# EAGLE design SBV0.3 (EAGLE 7.7.0)
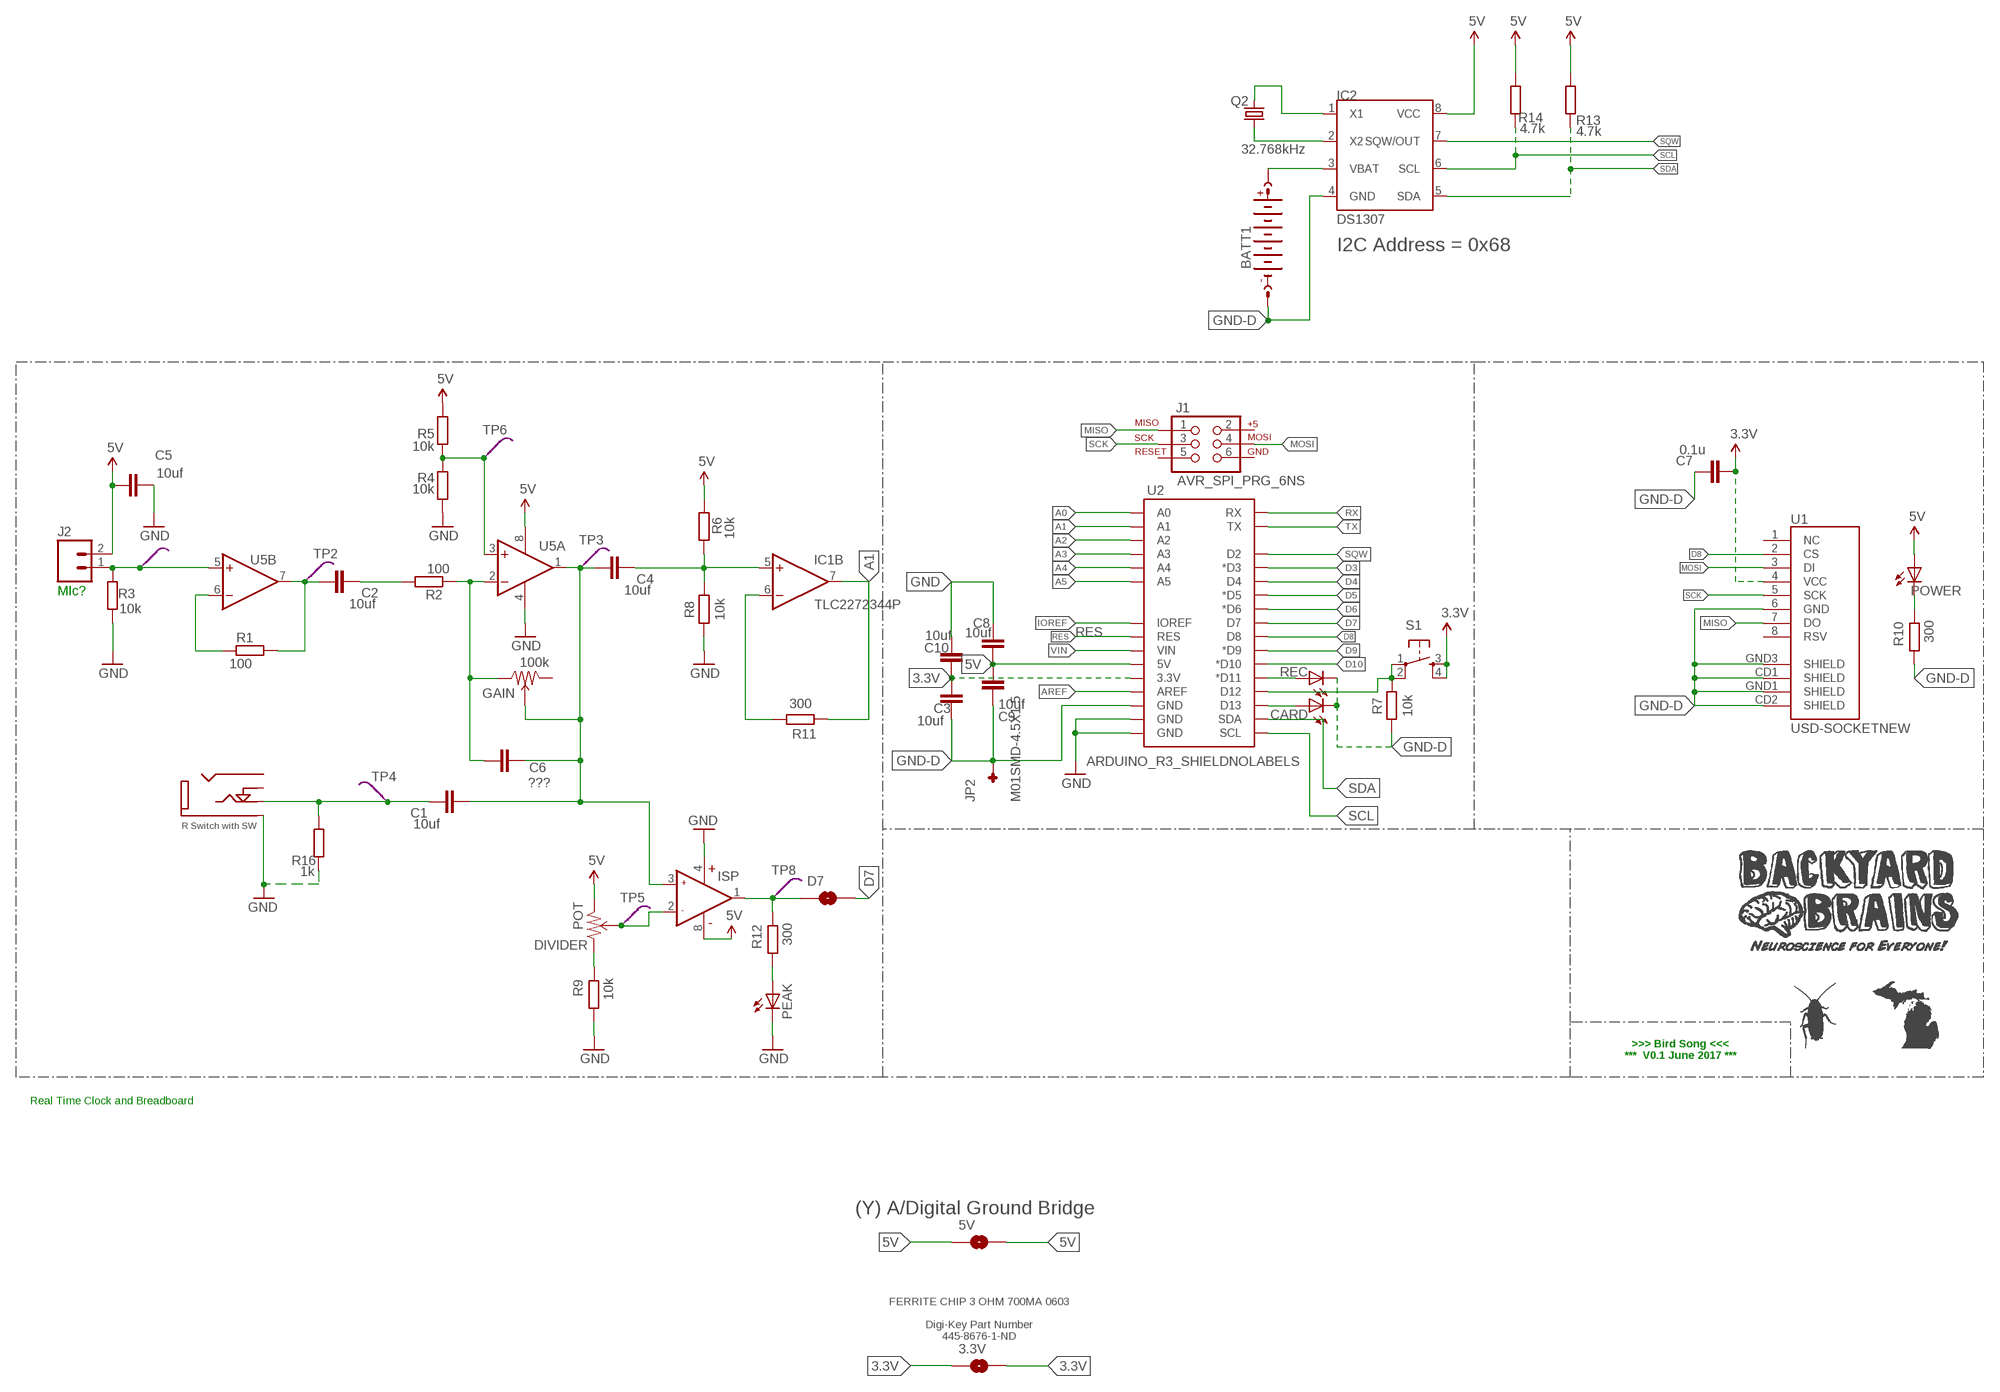
[diagram p0: schematic, sheet 1]

## Parts
3.3V  SOLDERJUMPERTRACE  [SJ_2S-TRACE]
5V  SOLDERJUMPERTRACE  [SJ_2S-TRACE]
BATT1  BATTERY-16MMSMD  [16M_BATT_SMD]
C1  10uf  M2-CAP  [M2-CAP]
C2  10uf  M2-CAP  [M2-CAP]
C3  10uf  M2-CAP  [M2-CAP]
C4  10uf  M2-CAP  [M2-CAP]
C5  10uf  M2-CAP  [M2-CAP]
C6  ???  M2-CAP  [M2-CAP]
C7  0.1u  M2-CAP  [M2-CAP]
C8  10uf  M2-CAP  [M2-CAP]
C9  10uf  M2-CAP  [M2-CAP]
C10  10uf  M2-CAP  [M2-CAP]
CARD  LED5MM  [LED5MM]
D7  SOLDERJUMPERTRACE  [SJ_2S-TRACE]
DIVIDER  POT  [BURNS-SCREW-POT]
GAIN  100k  POT  [BURNS-SCREW-POT]
IC1  TLC2272344P  [DIL08]
IC2  DS1307  [DIL08]
J1  AVR_SPI_PRG_6NS  [2X3-NS]
J2  M02PTH  [1X02]
J3  AUDIOJACK  [3.5MM-SMALL-JACK-NEW]
JP2  M01SMD-4.5X1.5  [PAD-1.5X4.5]
PEAK  LED5MM  [LED5MM]
POWER  LED5MM  [LED5MM]
Q2  32.768kHz  CRYSTALTC26H  [TC26H]
R1  100  R-EU_0309/V  [0309V]
R2  100  R-EU_0309/V  [0309V]
R3  10k  R-EU_0309/V  [0309V]
R4  10k  R-EU_0309/V  [0309V]
R5  10k  R-EU_0309/V  [0309V]
R6  10k  R-EU_0309/V  [0309V]
R7  10k  R-EU_0309/V  [0309V]
R8  10k  R-EU_0309/V  [0309V]
R9  10k  R-EU_0309/V  [0309V]
R10  300  R-EU_0309/V  [0309V]
R11  300  R-EU_0309/V  [0309V]
R12  300  R-EU_0309/V  [0309V]
R13  4.7k  R-EU_0309/V  [0309V]
R14  4.7k  R-EU_0309/V  [0309V]
R16  1k  R-EU_0309/V  [0309V]
REC  LED5MM  [LED5MM]
S1  TAC_SWITCHPTH  [TACTILE-PTH]
TP1  TEST  [PROBE_TP]
TP2  TEST  [PROBE_TP]
TP3  TEST  [PROBE_TP]
TP4  TEST  [PROBE_TP]
TP5  TEST  [PROBE_TP]
TP6  TEST  [PROBE_TP]
TP8  TEST  [PROBE_TP]
U1  USD-SOCKETNEW  [MICRO-SD-SOCKET-PP]
U2  ARDUINO_R3_SHIELDNOLABELS  [UNO_R3_SHIELD_NOLABELS]
U5  TLC2272344P  [DIL08]

## Nets
3.3V: 3.3V.1 3.3V.2 C3.1 C7.1 C10.1 S1.3 S1.4 U1.4(VCC) U2.3.3V
5V: 5V.1 5V.2 C5.1 C8.2 C9.2 DIVIDER.1 IC1.8(A:V+) IC2.8(VCC) J2.2 POWER.A R5.2 R6.1 R13.2 R14.2 U2.5V U5.8(A:V+)
A0: U2.A0
A1: IC1.7(B:OUT) R11.2 U2.A1
A2: U2.A2
A3: U2.A3
A4: U2.A4
A5: U2.A5
AMP2: C2.1 R1.2 TP2.P$1(TP) U5.7(B:OUT)
AREF: U2.AREF
ASD: D7.1 IC1.1(A:OUT) R12.1 TP8.P$1(TP)
D3: U2.D3(*D3)
D4: U2.D4
D5: U2.D5(*D5)
D6: U2.D6(*D6)
D7: D7.2 U2.D7
D8: U1.2(CS) U2.D8
D9: U2.D9(*D9)
D10: U2.D10(*D10)
FILTER: C1.1 C4.1 C6.2 GAIN.2 IC1.3(A:IN+) TP3.P$1(TP) U5.1(A:OUT)
GND: C5.2 C8.1 C10.2 IC1.4(A:V-) J3.SHIELD PEAK.K(C) R3.1 R4.1 R8.2 R9.2 R16.1 U2.GND@0(GND) U2.GND@1(GND) U5.4(A:V-)
GND-D: BATT1.NEG(-) C3.2 C7.2 C9.1 CARD.K(C) IC2.4(GND) JP2.P$1 R7.2 R10.2 REC.K(C) U1.6(GND) U1.CD1(SHIELD) U1.CD2(SHIELD) U1.GND1(SHIELD) U1.GND3(SHIELD) U2.GND@2(GND)
IOREF: U2.IOREF
MISO: J1.1 U1.7(DO)
MOSI: J1.4 U1.3(DI)
N$1: J2.1 R3.2 TP1.P$1(TP) U5.5(B:+IN)
N$2: REC.A U2.D11(*D11)
N$3: R1.1 U5.6(B:-IN)
N$4: C2.2 R2.2
N$5: R4.2 R5.1 TP6.P$1(TP) U5.3(A:+IN)
N$6: POWER.K(C) R10.1
N$7: DIVIDER.3 R9.1
N$8: IC2.1(X1) Q2.2
N$9: IC1.6(B:-IN) R11.1
N$10: IC2.2(X2) Q2.1
N$11: DIVIDER.2 IC1.2(A:IN-) TP5.P$1(TP)
N$12: R7.1 S1.1 S1.2 U2.D12
N$13: CARD.A U2.D13
N$14: PEAK.A R12.2
N$15: BATT1.POS1(+) BATT1.POS2(+) IC2.3(VBAT)
N$17: C1.2 J3.R R16.2 TP4.P$1(TP)
N$21: C6.1 GAIN.3 R2.1 U5.2(A:-IN)
PREA1: C4.2 IC1.5(B:+IN) R6.2 R8.1
RES: U2.RES
RX: U2.RX
SCK: J1.3 U1.5(SCK)
SCL: IC2.6(SCL) R14.1 U2.SCL
SDA: IC2.5(SDA) R13.1 U2.SDA
SQW: IC2.7(SQW/OUT) U2.D2
TX: U2.TX
VIN: U2.VIN
Unconnected: GAIN.1 J1.2 J1.5 J1.6 J3.L J3.SW(SWITCH) U1.1(NC) U1.8(RSV)

## Notes on the sheet
- I2C Address = 0x68
- MIc?
- >>> Bird Song <<<
  ***  V0.1 June 2017 ***
- Real Time Clock and Breadboard
- (Y) A/Digital Ground Bridge
- FERRITE CHIP 3 OHM 700MA 0603
  
  Digi-Key Part Number
  445-8676-1-ND

## Library data of the parts
3.3V 5V D7 = SparkFun:SOLDERJUMPER: Solder Jumper Standard SMD solder jumper. Used to automate production. Two varients : Normally Open and Normally Closed are the same, but have different paste layers. NC will have a large amount of paste and should jumper during reflow.
BATT1 = byb:BATTERY-16MM
C1-C10 = 1MaxBYB:M2-CAP; DIGIKEY: BC1150CT-ND; MANUFACTURER: Vishay/BC Components; PARTNO: K474Z20Y5VE5TL2
CARD PEAK POWER REC = SparkFun-LED:LED: LEDs Standard schematic elements and footprints for 5mm, 3mm, 1206, and 0603 sized LEDs. 5mm - Spark Fun Electronics SKU : COM-00529 (and others)
DIVIDER GAIN = 1MaxBYB:POT
IC1 = 1MaxBYB:TLC2272: Dual Operational Amplifier Low Power, Single-Supply, Rail-To-Rail Operational Amplifier Source: http://focus.ti.com/lit/ds/symlink/opa2345.pdf http://focus.ti.com .. opa241.pdf http://focus.ti.com/lit/ds/symlink/opa2134.pdf
IC2 = 1MaxBYB:DS1307: I2C Serial RTC w/56 bytes battery backed RAM
J1 = SparkFun-Connectors:AVR_SPI_PRG_6: AVR ISP 6 Pin This is the reduced ISP connector for AVR programming. Common on Arduino. This footprint will take up less PCB space and can be used with a 10-pin to 6-pin adapter such as SKU: BOB-08508
J2 = SparkFun-Connectors:M02: Standard 2-pin 0.1" header. Use with - straight break away headers ( PRT-00116) - right angle break away headers (PRT-00553) - swiss pins (PRT-00743) - machine pins (PRT-00117) - female headers (PRT-00115) Molex polarized connector foot print use with: PRT-08233 with associated crimp pins and housings. 2.54_SCREWTERM for use with PRT-10571. 3.5mm Screw Terminal footprints for PRT-08084 5mm Screw Terminal footprints for use with PRT-08432
J3 = MaxBYB:AUDIOJACK: 1/8" Audio Jack
JP2 = 1MaxBYB:M01: Header 1 Standard 1-pin 0.1" header. Use with straight break away headers (SKU : PRT-00116), right angle break away headers (PRT-00553), swiss pins (PRT-00743), machine pins (PRT-00117), and female headers (PRT-00115).
Q2 = 1MaxBYB:CRYSTAL: CRYSTAL; OC_FARNELL: unknown; OC_NEWARK: unknown
R1 R2 R4 R5 R9 R10 R12 = resistor:R-EU_: RESISTOR, European symbol; DIGIKEY: CF14JT390RCT-ND; MANUFACTURER: Stackpole Electronics; PARTNO: CF14JT390R
R3 R6-R8 R11 R13 R14 R16 = resistor:R-EU_: RESISTOR, European symbol; DIGIKEY: P1.0KBACT-ND; MANUFACTURER: Panasonic - ECG; PARTNO: ERD-S2TJ102V
S1 = 1MaxBYB:TAC_SWITCH: Momentary Switch Button commonly used for reset or general input. Spark Fun Electronics SKU : COM-00097
TP1-TP6 TP8 = 1MaxBYB:TEST
U1 = SparkFun:USD-SOCKET: microSD Socket Push-push type uSD socket. Schematic element and footprint production proven. Spark Fun Electronics SKU : PRT-00127. tDoc lines correctly indicate media card edge positions when inserting (unlocked, locked, depressed).
U2 = SparkFun-Boards:ARDUINO_R3_SHIELD: Shield form compatible with the Arduino Uno R3.
U5 = byb:TLC2272: Dual Operational Amplifier Low Power, Single-Supply, Rail-To-Rail Operational Amplifier Source: http://focus.ti.com/lit/ds/symlink/opa2345.pdf http://focus.ti.com .. opa241.pdf http://focus.ti.com/lit/ds/symlink/opa2134.pdf; DIGIKEY: 296-1812-5-ND; MANUFACTURER: TEXAS INSTRUMENTS; PARTNO: TLC2272CP

## Board
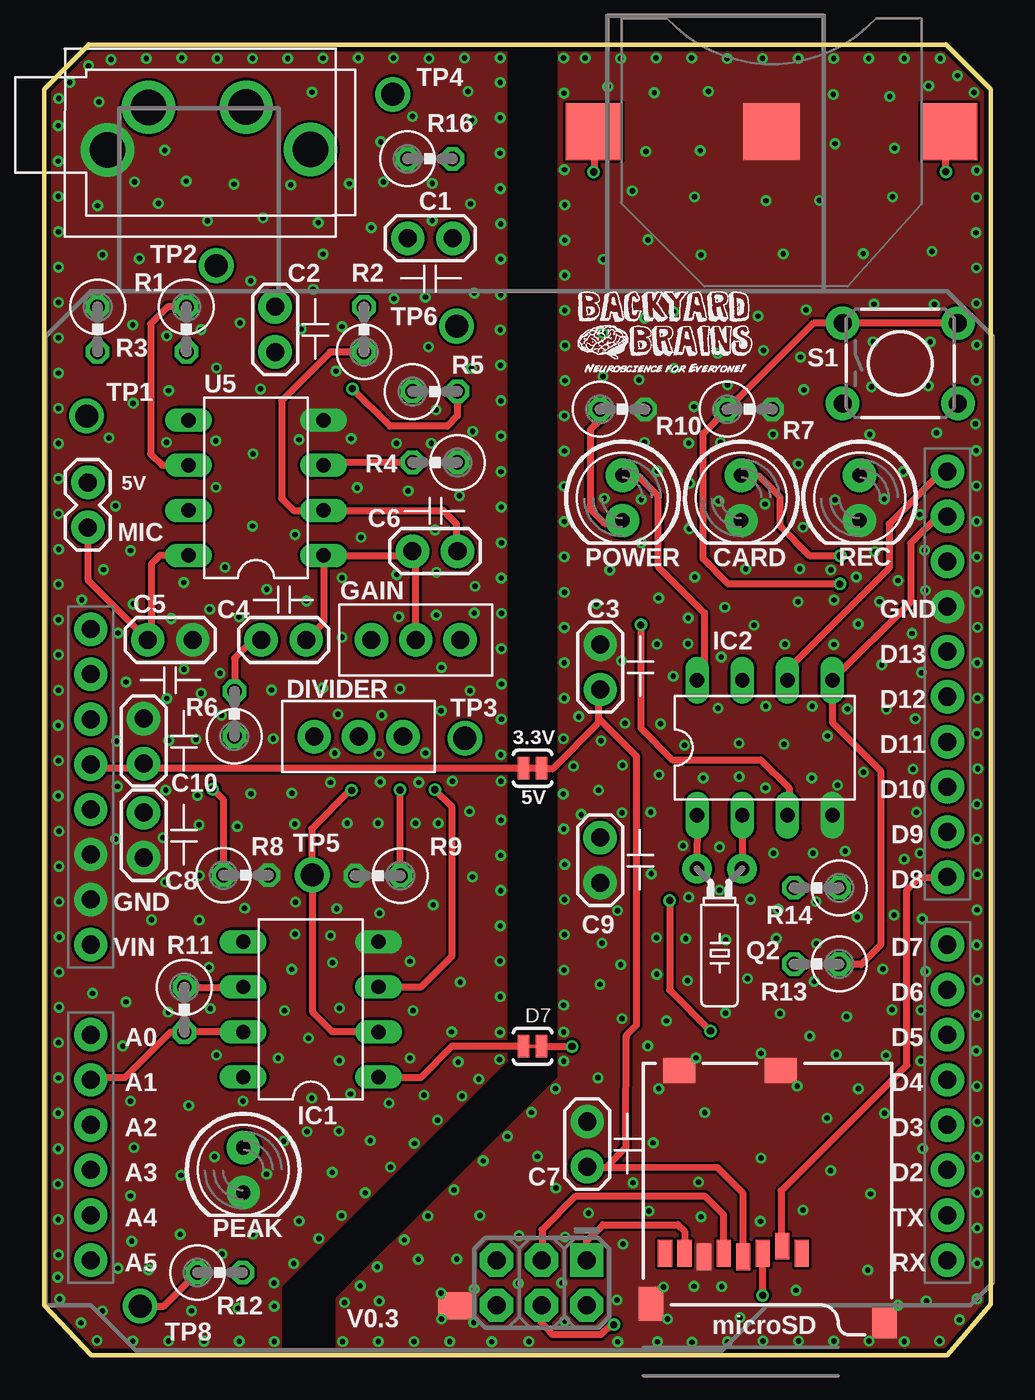
[diagram p1: board, top side]
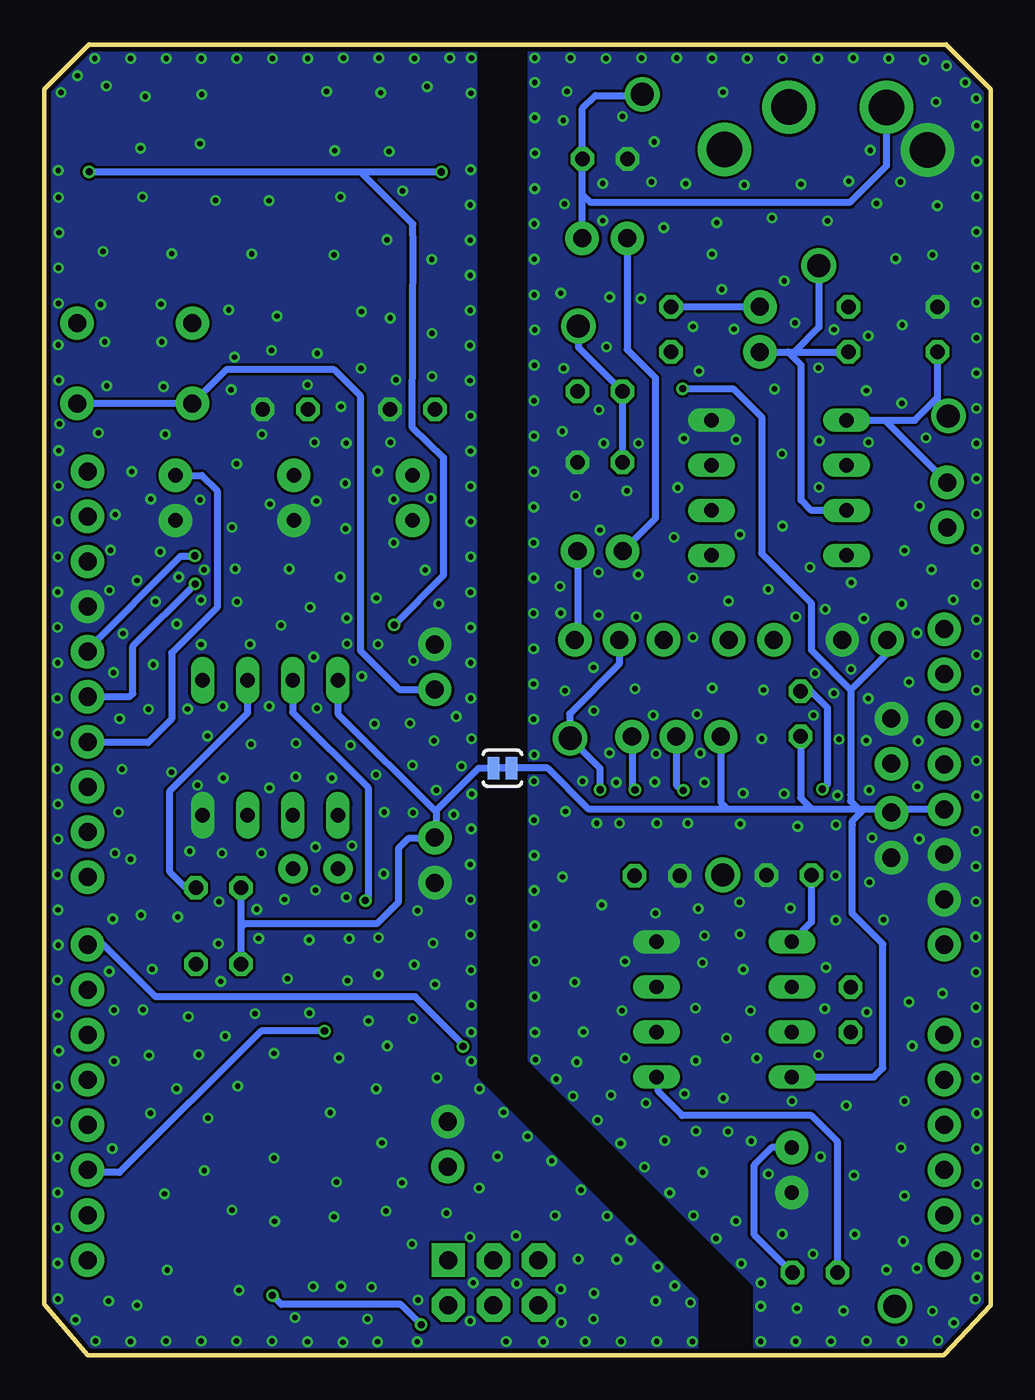
[diagram p2: board, bottom side, seen from below]

Size 53.3 x 73.86 mm. Coordinates in mm from the lower left corner, seen from the top.
Outline: 53.3,2.88 53.3,71.32 50.77,73.86
Outline: 2.5,73.85 0,71.32 0,2.81 2.65,0 50.87,0 53.3,2.86
Outline: 2.5,73.85 2.51,73.86
Outline: 2.5,73.85 50.8,73.85
Copper layers (1*16): Top 0.035mm / dielectric 1.5mm / Bottom 0.035mm
Design rules "SeeedStudio_2layer_DRU_no_angle_20140221-1 *": minimum track width 0.156mm, minimum drill 0.3mm, track to track 6mil, track to pad 6mil, pad to pad 6mil, via to via 6mil, smd to smd 0mil, copper to edge 10mil, drill to drill 10mil, minimum pad ring 10mil, minimum via ring 6mil, stop-mask expansion 2mil, vias tented up to drill 100mil, thermal gap 10mil

### Footprints (pad centres in the part's own frame; a part is rotated, then mirrored left to right if it is on the bottom)
SJ_2S-TRACE = smd 0.635 x 1.27: 1 -0.508,0; 2 0.508,0
16M_BATT_SMD = smd 3.2 x 3.2: NEG 0,0; POS1 -10,0; POS2 10,0
M2-CAP = drill 1.016 pad 1.88: 1 -1.27,0; 2 1.27,0
LED5MM = drill 0.813 pad 1.88: A -1.27,0; K 1.27,0
BURNS-SCREW-POT = drill 1.016 pad 1.88: 1 -2.5,0; 2 0,0; 3 2.5,0
DIL08 = drill 0.813 pad 1.27 long: 1 -3.81,-3.81; 2 -1.27,-3.81; 3 1.27,-3.81; 4 3.81,-3.81; 5 3.81,3.81; 6 1.27,3.81; 7 -1.27,3.81; 8 -3.81,3.81
2X3-NS = drill 1.016 pad 1.88 square: 1 -2.54,-1.27 | drill 1.016 pad 1.88 octagon: 2 -2.54,1.27; 3 0,-1.27; 4 0,1.27; 5 2.54,-1.27; 6 2.54,1.27
1X02 = drill 1.016 pad 1.88: 1 0,0; 2 2.54,0
3.5MM-SMALL-JACK-NEW = drill 2 pad 2.184: L 3.645,1.202; R -1.849,1.192; SHIELD -4.159,-1.205; SW 7.271,-1.185
PAD-1.5X4.5 = smd 1.5 x 2: P$1 0,0
TC26H = drill 0.813 pad 1.676: 1 -1.27,0; 2 1.27,0
0309V = drill 0.813 octagon: 1 -1.27,0; 2 1.27,0
TACTILE-PTH = drill 1.016 pad 1.88: 1 -3.251,2.261; 2 3.251,2.261; 3 -3.251,-2.261; 4 3.251,-2.261
PROBE_TP = drill 1.3 pad 1.7: P$1 0,0
MICRO-SD-SOCKET-PP = smd 0.8 x 1.5: 1 -8.94,10.7; 2 -7.84,10.3; 3 -6.74,10.7; 4 -5.64,10.9; 5 -4.54,10.7; 6 -3.44,10.9; 7 -2.34,10.7; 8 -1.24,10.7 | smd 1.8 x 1.4: CD1 -2.05,0.4; CD2 -7.75,0.4 | smd 1.4 x 1.9: GND1 -13.6,14.55; GND3 -0.45,13.55
UNO_R3_SHIELD_NOLABELS = drill 1.016 pad 1.88: 3.3V 50.8,26.67; 5V 50.8,29.21; A0 50.8,41.91; A1 50.8,44.45; A2 50.8,46.99; A3 50.8,49.53; A4 50.8,52.07; A5 50.8,54.61; AREF 2.54,15.24; D2 2.54,49.53; D3 2.54,46.99; D4 2.54,44.45; D5 2.54,41.91; D6 2.54,39.37; D7 2.54,36.83; D8 2.54,33.02; D9 2.54,30.48; D10 2.54,27.94; D11 2.54,25.4; D12 2.54,22.86; D13 2.54,20.32; GND@0 50.8,31.75; GND@1 50.8,34.29; GND@2 2.54,17.78; IOREF 50.8,21.59; NC 50.8,19.05; RES 50.8,24.13; RX 2.54,54.61; SCL 2.54,10.16; SDA 2.54,12.7; TX 2.54,52.07; VIN 50.8,36.83

### Placement (x,y rotation side)
3.3V  27.5,33.07 0 top
5V  27.5,33.07 0 bottom
BATT1  40.96,68.94 0 top
C1  21.74,62.93 0 top
C2  13,57.8 90 top
C3  31.31,38.78 90 top
C4  13.48,40.3 180 top
C5  7.09,40.3 0 top
C6  22,45.3 180 top
C7  30.58,11.89 90 top
C8  5.59,29.3 90 top
C9  31.3,27.89 90 top
C10  5.59,34.6 90 top
CARD  39.25,48.3 270 top
D7  27.5,17.4 0 top
DIVIDER  17.7,34.85 0 top
GAIN  20.92,40.3 0 top
IC1  15.01,19.48 90 top
IC2  40.58,34.23 0 top
J1  28.01,4.08 180 top
J2  2.45,49.18 270 top
J3  7.72,69.12 0 top
JP2  23.18,2.78 270 top
PEAK  11.2,10.43 270 top
POWER  32.56,48.3 270 top
Q2  38.03,27.41 180 top
R1  8,57.8 270 top
R2  18,57.8 90 top
R3  3,57.8 270 top
R4  22,50.3 180 top
R5  22,54.3 0 top
R6  10.7,36.14 90 top
R7  39.73,53.3 0 top
R8  11.36,27.04 0 top
R9  18.78,27.02 180 top
R10  32.57,53.3 0 top
R11  7.88,19.46 270 top
R12  9.89,4.65 0 top
R13  43.5,22.04 180 top
R14  43.5,26.33 180 top
R16  21.72,67.41 0 top
REC  45.92,48.3 270 top
S1  48.21,55.89 0 top
TP1  2.38,52.92 0 top
TP2  9.68,61.39 0 top
TP3  23.69,34.76 0 top
TP4  19.62,71.04 0 top
TP5  15.09,27.06 180 top
TP6  23.22,57.98 180 top
TP8  5.39,2.76 0 top
U1  33.72,16.44 180 top
U2  53.41,59.96 180 top
U5  11.92,48.87 90 top
U$1  [LOGO-NEW-SMALL]  29.92,54.63 0 top

### Tracks (layer width: path | path; a pad name or v marks a point on that pad's centre or on a via)
3.3V
  Top 0.4: 31.22,35.87 31.22,35.64 28.65,33.07 3.3V.2 3.3V.1 5.68,33.07 | 31.22,35.87 31.22,37.42 C3.1 | 5.68,33.07 2.83,33.07 U2.3.3V | 30.41,10.69 C7.1 30.64,10.56 31.61,10.56 | 33.31,33.78 31.22,35.87 | U1.4 39.36,9.11 37.9,10.57 32.88,10.56 31.61,10.56 | 31.61,10.56 32.75,11.7 32.75,12.25 32.78,17.93 32.78,18.03 33.34,18.59 33.34,33.75 33.31,33.78 | C10.1 5.68,33.07 | 33.31,33.78 33.32,33.78
  Bottom 0.4: S1.4 S1.3 43.06,55.53 36.98,55.53 35.48,54.03 35.48,39.69 33.3,37.51 C3.1
5V  (via drill 0.4)
  Top 0.4: POWER.A 32.67,49.46 33.54,49.46 34.59,48.41 34.59,44.41 37.17,41.83 37.17,38.44 IC2.8 | 5.73,40.21 C5.1 | U5.8 6.5,45.06 6.03,44.59 6.03,40.51 C5.1 | J2.2 2.45,43.67 C5.1 | R5.2 23.27,52.93 22.68,52.34 19.47,52.34 v17.35,54.46
  Bottom 0.4: 5V.1 28.86,33.07 31.24,30.69 31.24,30.61 | 31.24,30.61 31.24,29.22 C9.2 31.32,29.14 32.77,29.14 33.34,28.57 33.34,25.54 33.73,25.15 33.74,25.15 34.59,24.3 42.01,24.3 42.23,24.08 | IC2.8 36.77,36.14 31.24,30.61 | U2.5V 5.57,30.75 | 5.57,30.75 7.15,30.75 | 7.15,30.75 7.41,30.75 | 7.41,30.75 10.05,30.75 | 10.05,30.75 14.8,30.75 | 14.8,30.75 22.63,30.75 24.96,33.08 28,33.08 5V.1 | R14.2 42.23,24.08 | 42.23,24.08 R13.2 | IC1.8 6.58,15.67 6.07,16.18 6.07,23.16 7.8,24.89 7.79,29.89 7.79,30.11 7.15,30.75 | C8.2 5.57,30.75 | R6.1 10.7,31.4 10.05,30.75 | DIVIDER.1 15.2,31.15 14.8,30.75 | 7.87,37.49 5.73,39.63 5.73,40.21 C5.1 | 7.87,37.49 7.88,31.57 7.88,31.22 7.41,30.75 | v17.35,54.46 14.5,54.46 12.9,52.86 12.9,45.17 10.1,42.37 10.1,39.72 7.87,37.49 | 5V.2 5V.1
A1
  Top 0.4: IC1.7 7.86,18.21 | U2.A1 2.73,15.63 4.53,15.63 7.11,18.21 7.86,18.21 | 7.86,18.21 R11.2
AMP2
  Bottom 0.4: C2.1 11.41,56.53 | 11.41,56.53 11.07,56.53 | 11.07,56.53 R1.2 | TP2.P$1 9.68,57.92 11.07,56.53 | U5.7 10.1,47.6 10.68,48.18 10.68,55.8 11.41,56.53
ASD
  Top 0.4: D7.1 22.96,17.4 21.19,15.63 18.86,15.63 IC1.1 | TP8.P$1 6.73,2.76 R12.1
  Bottom 0.4: R12.1 8.62,12.03 10.1,13.51 17.37,13.51 18.71,14.85 18.71,15.56 IC1.1
D7  (via drill 0.4)
  Top 0.4: D7.2 v29.71,17.4 v29.72,17.39
  Bottom 0.4: v29.72,17.39 29.72,17.51 32.4,20.19 47.04,20.19 50.02,23.17 50.83,23.17 U2.D7
D8
  Top 0.4: U1.2 41.5,6.2 41.5,9.27 48.23,16 48.25,16 48.58,16.33 48.58,26.22 49.27,26.91 49.98,26.91 50.01,26.88 50.07,26.94 U2.D8
FILTER  (via drill 0.4)
  Top 0.4: IC1.3 21.22,20.75 22.97,22.5 22.97,30.88 v21.99,31.86 | GAIN.2 20.92,45.11 C6.2 20.49,45.06 U5.1 15.73,41.28 C4.1
  Bottom 0.4: v21.99,31.86 21.99,33.06 TP3.P$1 23.72,34.79 23.72,36.14 20.92,38.94 GAIN.2 | C1.1 20.47,56.66 18.88,55.07 18.88,47.15 C6.2
GND  (via drill 0.3)
  other vias: 0.86,3.16 2.07,1.82 2.97,0.83 4.98,0.79 6.99,0.79 8.99,0.78 10.98,0.78 12.95,0.76 12.95,2.75 12.93,4.07 14.05,5.16 15.46,6.57 16.74,7.86 18.07,9.15 19.5,10.59 20.84,11.93 22.15,13.25 23.52,14.59 25.64,16.65 24.47,15.55 25.66,18.19 25.68,20.2 25.66,22.2 25.68,24.19 25.71,26.18 25.71,28.16 25.72,30.15 25.72,32.34 25.71,33.83 25.74,35.83 25.75,37.82 25.74,39.8 25.75,41.8 25.73,43.79 25.74,45.78 25.73,47.79 25.72,49.79 25.72,51.79 25.72,53.78 25.7,55.78 25.68,57.77 25.71,59.75 25.71,61.76 25.71,63.75 25.68,65.73 25.67,67.73 25.68,69.73 25.68,71.71 25.68,73.09 23.67,73.1 21.67,73.07 19.67,73.09 17.68,73.09 15.69,73.08 13.71,73.07 11.73,73.06 9.74,73.06 7.74,73.09 5.74,73.07 3.75,73 2.48,72.65 1.43,71.71 0.81,70.81 0.78,69.28 0.78,67.28 0.78,65.29 0.79,63.3 0.79,61.31 0.8,59.32 0.8,57.32 0.8,55.34 0.8,53.35 0.8,51.37 0.8,49.39 0.8,47.4 0.81,45.41 0.8,43.43 0.8,41.44 0.8,39.46 0.79,37.47 0.78,35.48 0.79,33.49 0.78,31.51 0.82,29.52 0.83,27.54 0.83,25.55 0.84,23.56 0.83,21.58 0.83,19.6 0.8,17.61 0.8,15.62 0.78,13.63 0.78,11.63 0.77,9.64 0.78,7.64 0.79,5.65 0.75,4.39 10.9,2.64 8.28,2.5 3.28,2.48 4.15,4.89 5.87,4.81 10,5.7 4.92,6.42 4.85,8.98 5.05,11.69 4.85,14.32 8.13,14.06 7.69,10.13 7.65,6.81 9.58,11.18 12.52,10.2 11.74,6.82 14.35,7.55 13.48,12.06 11.19,14.32 15.06,14.49 17.25,14.72 19.41,14.2 16.59,12.62 14.8,12.59 20.6,16.74 23.31,16.52 22.94,18.21 21.39,14.65 16.61,16.59 13.17,16.73 9.69,16.91 4.41,17.42 4.59,19.9 2.71,20.38 6.98,19.33 9.34,19.53 9.28,21.85 14.15,25.53 13.93,21.74 14.88,17.86 16.62,19.56 16.23,22.11 16.47,25.15 20.76,19.41 20.59,22.19 23.43,21.02 21.9,25.37 24.11,26.95 22.19,29.97 23.95,30.64 22.98,32.34 21.09,32.27 18.92,32.3 16.12,32.27 16.36,33.92 18.85,33.89 21.47,33.93 20.9,29.97 18.8,29.98 17.06,29.98 14.1,29.93 10.87,29.79 11.63,31.63 13.94,31.67 11.28,25.19 14.12,23.72 16.12,23.63 6.04,24.53 8.72,24.51 6.68,29.15 4.11,32.04 4.02,29.09 6.84,31.83 7.01,34.63 4.08,34.6 8.62,31.54 8.71,29.88 13.52,19.41 6.82,26.65 8.73,27.02 8.54,34.7 8.83,37.29 9.89,38.43 7.87,38.65 6.89,37 9.98,36.06 12.89,34.74 12.79,37.48 15.68,37.59 20.03,37.55 16.54,36.11 19,36.06 22.35,36.31 22.37,38.75 23.97,37.43 22.09,44.11 22.08,41.7 24.25,43.32 24.21,41.82 19.85,43.99 19.96,41.61 16.76,43.8 16.77,40.45 10.97,41.6 9.31,42.03 5.01,42.33 2.1,42.57 3.33,44.27 7.85,43.53 4.15,40.69 4.6,37.93 7.14,41.51 18.88,24.91 14.77,42.49 12.53,43.15 10.17,44.39 4.85,45.34 9.67,48.9 14.12,46.24 17.83,46.08 22,46.49 20.49,48.7 17.62,48.88 14.34,51.59 17.28,51.65 19.84,51.38 21.79,51.38 22.06,53.27 16.42,55.45 23.38,48.42 24.13,52.05 21.63,56.82 24.05,55.61 24.21,59.84 21.46,59.62 19.69,59.53 16.77,57.95 11.02,58.16 8.82,57.79 6.89,57.43 7,54.35 6.88,51.44 3.64,51.69 12.17,54.44 11.75,50.79 11.72,46.72 4.01,47.85 5,53.64 4.98,58.06 9.69,55.63 9.65,51.52 15.14,60.05 11.62,60.53 21.85,63.93 21.85,66.03 24,64.87 24.07,69.57 23.86,71.2 20.74,69.8 18.95,68.37 19.1,66.11 18.41,63.53 17.17,66.01 15.43,63.81 13.88,65.94 12.31,64.08 10.68,65.98 9.19,63.91 7.99,66.15 6.42,64.89 6.78,67.89 5.08,66.11 15.08,71.16 3.28,62 3,64.77 3.07,70.61 5.35,61.79 15.7,62.04 14.46,57.81 16.22,10.3 18.36,12.09
  pour Top (no thermals): 26,75.33 26,16.58 13.3,3.89 13.3,0.37 -0.73,0.37 -0.73,75.33
  pour Bottom (no thermals): 26,74.71 26,16.61 13.3,3.9 13.3,0.37 0.08,0.37 0.08,74.71
GND-D  (via drill 0.3)
  other vias: 16.9,2.96 16.8,0.77 18.81,0.77 20.82,0.77 22.83,0.77 25.2,0.75 27.29,0.77 40.48,0.79 42.48,0.79 44.47,0.79 46.45,0.79 48.44,0.77 50.42,0.79 51.54,1.99 52.53,3.17 52.55,5.17 52.55,7.16 52.55,9.16 52.55,11.16 52.56,13.16 52.54,15.15 52.49,17.14 52.53,19.14 52.56,21.13 52.52,23.11 52.53,25.09 52.56,27.09 52.54,29.07 52.54,31.05 52.58,33.04 52.54,35.03 52.57,37.02 52.55,39.01 52.56,41.01 52.55,43 52.53,44.99 52.52,46.99 52.5,48.99 52.49,50.97 52.45,52.48 52.49,54.92 52.52,56.92 52.51,59.26 52.5,61.26 52.47,63.25 52.5,65.24 52.52,66.76 52.36,71.15 51.44,72.09 50.46,73.06 48.44,73.07 46.44,73.07 44.46,73.07 42.46,73.07 40.45,73.07 38.46,73.07 36.46,73.1 34.46,73.09 32.46,73.07 30.46,73.09 29.25,73.1 29.27,71.11 29.29,66.8 29.31,64.81 29.31,62.83 29.31,60.85 29.31,58.87 29.32,56.89 29.32,54.91 29.29,52.92 29.29,50.94 29.29,48.95 29.28,46.97 29.28,44.98 29.29,42.99 29.29,41 29.28,39.01 29.28,37.02 29.24,34.73 30.1,35.98 29.81,33.19 29.23,31.62 29.26,29.65 29.31,27.65 29.3,25.67 29.3,23.69 29.27,21.7 29.25,19.72 29.26,18.2 29.26,16.56 28.79,15.01 27.44,13.68 26.08,12.33 24.72,10.95 23.08,9.31 21.6,7.84 20.27,6.5 18.75,4.98 17.79,3.91 18.86,3.05 22.37,2.03 24.21,3.73 23.23,5.42 21.06,5.4 26.69,4.03 29.14,4.08 29.31,1.92 29.32,6.66 26.73,6.72 30.65,8.01 36.98,7.79 32.59,6.26 32.25,3.11 39.19,2.12 40.33,7.54 40.37,11.11 34.29,11.96 24.53,7.87 35.1,2.04 33.99,17.42 32.54,18.96 31.19,15.63 27.77,11.2 42.73,8.17 49.68,3.05 42.34,3.65 38.16,3.86 36.85,9.75 33.16,9.71 34.05,8.12 44.29,10.4 44.08,13.36 45.85,15.01 47.32,13.63 49.48,11.64 46.38,4.8 46.54,9.09 37.2,13.66 31.41,23.21 31.3,20.89 34.48,23.53 34.49,21.46 36.13,23.47 36.23,21.1 32.29,25.04 32.47,22 35.04,18.83 38.36,19.28 41.43,19.24 45.19,19.08 44.6,16.93 49.38,19.44 49.37,16.57 47.23,21.75 49.45,24.58 45.79,24.69 48.44,27.95 47.86,24.8 43.29,28.29 43.22,32.52 45.11,28.39 41.07,28.28 38.03,28.63 35.97,28.71 36.29,25.8 39.77,25.68 34.18,27.12 34.16,30.59 32.54,30.57 31.22,31.83 32.56,33.24 31.35,34.62 34.62,32.71 32.71,35.61 37.11,32.52 36.05,34.37 38.03,26.2 38.38,23.4 41.23,23.48 41.34,25.12 43.46,25.55 43.5,23.18 40.62,31.96 39.14,32.6 37.95,36.45 34.7,35.57 35.42,38.25 32.51,39.12 34.51,40.05 36.26,40.09 36.27,41.53 34.6,42.66 31.09,42.34 31.85,44.24 33.62,45.78 31.54,48.28 33.62,48.22 33.8,51.44 31.46,55.15 33.49,54.96 36.59,53.45 38.48,54.68 36.3,51.39 36.33,46.57 36.63,43.84 38.33,42.14 38.13,39.34 39.13,34.48 40.63,36.56 41.66,34.42 43.25,36.56 42.45,42.45 44.48,42.55 41.71,40.05 44.47,40.04 45.84,41.2 47.04,42.46 45.73,43.84 48.87,40.66 47.17,38.91 49.41,38.46 47.43,36.4 49.06,35.86 45.23,36.41 48.93,33.02 49.12,30.59 49.32,28.28 44.11,34.89 46.14,32.85 44.68,32.11 40.36,17 34.61,15.01 42.41,15.16 36.71,16.75 48.09,2.81 34.88,3.84 38.48,0.75 36.48,0.72 34.53,0.75 32.3,0.75 36.59,3.88 39.6,21.21 43.37,21.06 49.31,47.36 49.58,45.36 49.63,43.1 48.08,43.65 46.77,45.26 44.54,48.2 42.73,46.65 42.55,44.31 44.3,44.25 39.51,44.3 37.98,48.13 38.09,51.44 42.47,50.22 40.59,47.96 48.38,49.79 50.26,51.97 46.49,51.89 41.04,51.89 42.78,54.4 42.59,56.24 46.59,54.57 49.79,54.61 49.9,57.1 46.69,57.1 46.73,59.22 50.13,59.2 42.91,58.9 40.51,56.62 37.93,56.45 35.47,55.6 36.35,49.12 34.52,49.82 22.34,3.49 24.19,1.83 31.47,57.57 33.82,58.44 34,62.85 33.12,65.6 33.88,67.83 36.94,67.87 36.62,65.26 44.53,68.26 43.66,65.07 47.88,68.01 47.77,65.26 31.48,61.75 40.65,65.05 50,62.2 46.13,62.07 41.62,62.05 36.98,62 35.43,58.8 40.2,58.55 34.35,71.14 37.4,71.21 44.44,71.03 47.62,70.92 31.74,71.48 49.81,71.51 28.81,9.41 47.4,16.89 47.75,19.46 49.65,21.62 43.11,17.97 30.24,30.46 39.97,41.12 47.31,48.24
  pour Bottom (no thermals): 29,74.63 29,15.63 16.54,3.17 16.54,0.3 53.76,0.3 53.76,74.63
  pour Top (no thermals): 29,74.21 29,15.63 16.5,3.17 16.5,-4.7 53.46,-4.7 53.46,74.21
MISO
  Top 0.4: J1.1 30.55,6.43 31.47,7.35 35.69,7.35 36.07,6.97 U1.7
MOSI  (via drill 0.4)
  Top 0.4: J1.4 27.94,2.74 27.94,1.92 28.63,1.15 31.35,1.15 31.92,1.72 v32.08,1.72 | v40.46,3.37 U1.3
  Bottom 0.4: v32.08,1.72 33.22,2.86 39.95,2.86 v40.46,3.37
N$1
  Bottom 0.4: R3.2 3,53.95 | 3,53.95 3,53.54 TP1.P$1 | U5.5 5.95,52.68 | 5.95,52.68 J2.1 | 5.95,52.68 4.27,52.68 3,53.95
N$2
  Bottom 0.4: REC.A 44.43,49.57 43.57,48.71 43.57,42.13 46.13,39.57 46.13,35.85 47.46,34.52 50.83,34.52 U2.D11
N$3
  Top 0.4: R1.1 6.95,59.07 5.99,58.11 5.99,50.78 6.63,50.14 U5.6
N$4
  Bottom 0.4: R2.2 C2.2
N$5
  Top 0.4: R4.2 15.89,50.3 U5.3
  Bottom 0.4: R4.2 R5.1 23.22,56.79 TP6.P$1
N$6
  Top 0.4: POWER.K 32.4,46.87 31.57,46.87 30.76,47.68 30.76,52.14 31.3,52.68 R10.1
N$7  (via drill 0.4)
  Top 0.4: v20.03,31.85 20.03,27.04 R9.1
  Bottom 0.4: DIVIDER.3 20.2,31.97 v20.03,31.85
N$8
  Top 0.4: IC2.1 Q2.2
N$9
  Top 0.4: R11.1 11.18,20.73 IC1.6
N$10
  Top 0.4: IC2.2 Q2.1
N$11  (via drill 0.4)
  Top 0.4: v17.31,31.82 17.13,31.72 15.06,29.65 15.06,27.09 TP5.P$1 15.09,19.35 16.2,18.24 18.79,18.24 IC1.2
  Bottom 0.4: DIVIDER.2 17.7,32.11 v17.31,31.82
N$12  (via drill 0.4)
  Top 0.4: S1.2 S1.1 43.31,58.15 R7.1 37.1,51.94 37.1,44.88 38.52,43.46 v44.81,43.46
  Bottom 0.4: U2.D12 48.5,37.1 48.32,37.28 48.32,39.95 v44.81,43.46
N$13  (via drill 0.4)
  Top 0.4: v44.83,45.04 43.12,45.04 41.44,46.72 41.44,48.35 40.27,49.52 39.3,49.52 CARD.A
  Bottom 0.4: U2.D13 50.87,39.77 45.62,45.02 44.85,45.02 v44.83,45.04
N$14
  Bottom 0.4: PEAK.A 12.32,11.7 13.33,10.69 13.33,6.82 R12.2
N$15  (via drill 0.4)
  Top 0.4: BATT1.POS1 30.96,66.69 v30.94,66.67 | v50.78,66.68 50.78,68.76 BATT1.POS2 | v33.6,41.15 33.6,35.33 35.38,33.55 40.35,33.55 41.95,31.95 41.95,30.52 IC2.3
  Bottom 0.4: v30.94,66.67 35.47,66.67 | 35.47,66.67 v50.77,66.67 v50.78,66.68 | v33.6,41.15 30.82,43.93 30.82,50.58 32.6,52.3 32.54,63.04 32.54,63.74 35.47,66.67
N$17
  Bottom 0.4: J3.R 5.87,67.01 7.94,64.94 22.53,64.94 22.99,65.4 22.99,66.83 | 22.99,66.83 R16.2 22.99,70.25 22.26,70.98 19.68,70.98 TP4.P$1 | C1.2 23.01,66.81 22.99,66.83
N$21
  Top 0.4: C6.1 23.21,45.36 23.21,46.85 22.46,47.6 U5.2 14.89,47.6 14.87,47.58 14.85,47.6 14.04,47.6 13.36,48.28 13.36,53.8 16.09,56.53 R2.1
  Bottom 0.4: C6.1 23.27,40.45 GAIN.3
PREA1  (via drill 0.4)
  Top 0.4: R8.1 10.09,31.28 v9.48,31.89 | C4.2 11.74,40.3 10.71,39.27 R6.2
  Bottom 0.4: R8.1 10.09,24.4 IC1.5 | R6.2 10.12,37.41 9.2,36.49 9.2,32.17 v9.48,31.89 9.36,32.01
SCK
  Top 0.4: U1.5 38.26,7.91 37.23,8.94 29.91,8.94 28.04,7.07 28.04,5.38 J1.3
SCL
  Top 0.4: U2.SCL 50.56,49.8 47.59,46.83 47.59,44.35 41.85,38.61 IC2.6
  Bottom 0.4: R14.1 45.34,26.33 46.23,27.22 46.23,31.8 41.85,36.18 IC2.6
SDA
  Top 0.4: U2.SDA 50.31,47.26 48.8,45.75 48.8,42.45 IC2.5 44.39,35.65 47.11,32.93 47.11,23.11 46.01,22.01 44.8,22.01 R13.1
SQW  (via drill 0.4)
  Top 0.4: v35.22,25.62 35.22,20.57 v37.52,18.27
  Bottom 0.4: IC2.7 39.31,36.22 35.07,31.98 35.07,25.77 v35.22,25.62 | v37.52,18.27 41.09,18.27 49.07,10.29 50.73,10.29 U2.D2

### Text on the board
tPlace: GND | D13 | D12 | D11 | D10 | D9 | D8 | GND | VIN | D7 | D6 | A0 | D5 | A1 | D4 | A2 | D3 | A3 | D2 | A4 | TX | A5 | RX
tNames: 5V | MIC | V0.3 | microSD